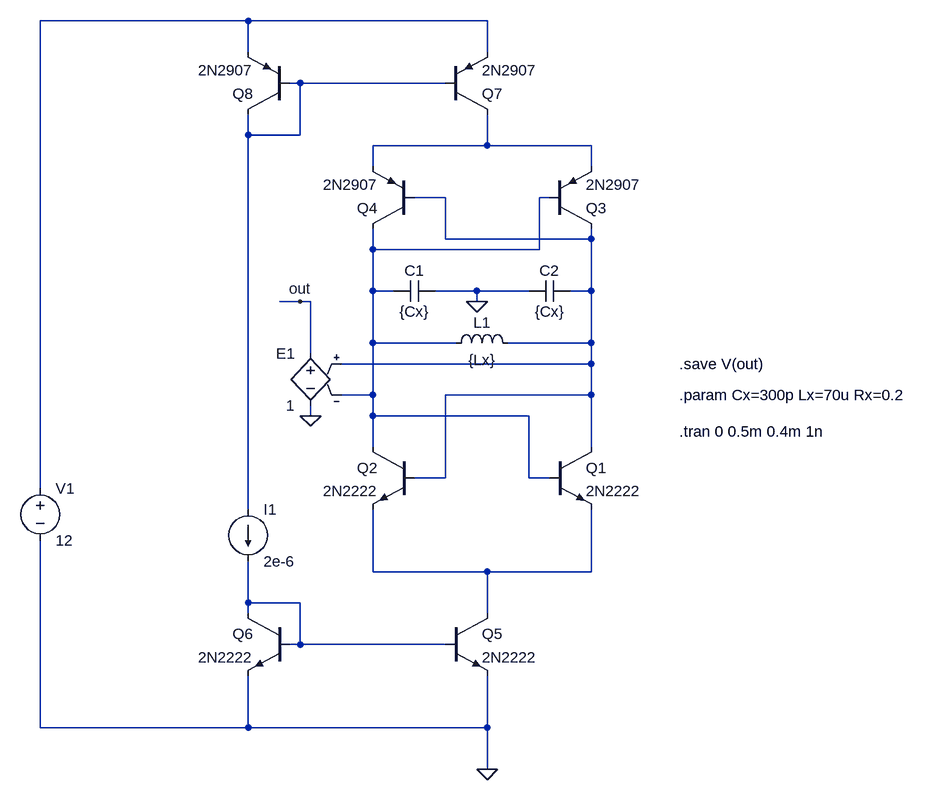
[diagram p0: schematic main.asc]
main.asc, the LTspice schematic file:
Version 4
SHEET 1 1056 692
WIRE -16 -480 -336 -480
WIRE 352 -480 -16 -480
WIRE -16 -432 -16 -480
WIRE 352 -432 352 -480
WIRE 64 -384 48 -384
WIRE 288 -384 64 -384
WIRE -16 -304 -16 -336
WIRE 64 -304 64 -384
WIRE 64 -304 -16 -304
WIRE 352 -288 352 -336
WIRE 352 -288 176 -288
WIRE 512 -288 352 -288
WIRE 176 -256 176 -288
WIRE 512 -256 512 -288
WIRE 288 -208 240 -208
WIRE 448 -208 432 -208
WIRE 288 -144 288 -208
WIRE 512 -144 512 -160
WIRE 512 -144 288 -144
WIRE 176 -128 176 -160
WIRE 432 -128 432 -208
WIRE 432 -128 176 -128
WIRE 176 -64 176 -128
WIRE 208 -64 176 -64
WIRE 336 -64 272 -64
WIRE 416 -64 336 -64
WIRE 512 -64 512 -144
WIRE 512 -64 480 -64
WIRE 64 -48 32 -48
WIRE 80 -48 64 -48
WIRE 336 -48 336 -64
WIRE 176 16 176 -64
WIRE 304 16 176 16
WIRE 512 16 512 -64
WIRE 512 16 384 16
WIRE 80 32 80 -48
WIRE 512 48 512 16
WIRE 512 48 128 48
WIRE 176 96 176 16
WIRE 176 96 128 96
WIRE 512 96 512 48
WIRE 512 96 288 96
WIRE 80 128 80 112
WIRE 176 128 176 96
WIRE 416 128 176 128
WIRE 176 176 176 128
WIRE 512 176 512 96
WIRE 288 224 288 96
WIRE 288 224 240 224
WIRE 416 224 416 128
WIRE 448 224 416 224
WIRE -336 240 -336 -480
WIRE -16 272 -16 -304
WIRE 176 368 176 272
WIRE 352 368 176 368
WIRE 512 368 512 272
WIRE 512 368 352 368
WIRE -16 416 -16 352
WIRE 64 416 -16 416
WIRE -16 432 -16 416
WIRE 352 432 352 368
WIRE 64 480 64 416
WIRE 64 480 48 480
WIRE 288 480 64 480
WIRE -336 608 -336 320
WIRE -16 608 -16 528
WIRE -16 608 -336 608
WIRE 352 608 352 528
WIRE 352 608 -16 608
WIRE 352 672 352 608
FLAG 336 -48 0
FLAG 352 672 0
FLAG 80 128 0
FLAG 64 -48 out
SYMBOL npn 448 176 R0
SYMATTR InstName Q1
SYMATTR Value 2N2222
SYMBOL npn 240 176 M0
SYMATTR InstName Q2
SYMATTR Value 2N2222
SYMBOL ind 288 32 R270
WINDOW 0 32 56 VTop 2
WINDOW 3 5 56 VBottom 2
SYMATTR InstName L1
SYMATTR Value {Lx}
SYMBOL cap 272 -80 R90
WINDOW 0 0 32 VBottom 2
WINDOW 3 32 32 VTop 2
SYMATTR InstName C1
SYMATTR Value {Cx}
SYMBOL cap 480 -80 R90
WINDOW 0 0 32 VBottom 2
WINDOW 3 32 32 VTop 2
SYMATTR InstName C2
SYMATTR Value {Cx}
SYMBOL voltage -336 224 R0
WINDOW 123 0 0 Left 0
WINDOW 39 0 0 Left 0
SYMATTR InstName V1
SYMATTR Value 12
SYMBOL pnp 448 -160 M180
SYMATTR InstName Q3
SYMATTR Value 2N2907
SYMBOL pnp 240 -160 R180
SYMATTR InstName Q4
SYMATTR Value 2N2907
SYMBOL npn 288 432 R0
SYMATTR InstName Q5
SYMATTR Value 2N2222
SYMBOL npn 48 432 M0
SYMATTR InstName Q6
SYMATTR Value 2N2222
SYMBOL current -16 272 R0
WINDOW 123 0 0 Left 0
WINDOW 39 0 0 Left 0
SYMATTR InstName I1
SYMATTR Value 2e-6
SYMBOL pnp 288 -336 M180
SYMATTR InstName Q7
SYMATTR Value 2N2907
SYMBOL pnp 48 -336 R180
SYMATTR InstName Q8
SYMATTR Value 2N2907
SYMBOL e 80 16 M0
SYMATTR InstName E1
SYMATTR Value 1
TEXT 648 96 Left 2 !.param Cx=300p Lx=70u Rx=0.2
TEXT 648 48 Left 2 !.save V(out)
TEXT 648 152 Left 2 !.tran 0 0.5m 0.4m 1n

The netlist it stands for:
* main.asc
Q1 N004 N005 N006 0 2N2222
Q2 N005 N004 N006 0 2N2222
L1 N005 N004 {Lx}
C1 0 N005 {Cx}
C2 N004 0 {Cx}
V1 N001 0 12
Q3 N004 N005 N003 0 2N2907
Q4 N005 N004 N003 0 2N2907
Q5 N006 N007 0 0 2N2222
Q6 N007 N007 0 0 2N2222
I1 N002 N007 2e-6
Q7 N003 N002 N001 0 2N2907
Q8 N002 N002 N001 0 2N2907
E1 out 0 N004 N005 1
.model NPN NPN
.model PNP PNP
.lib standard.bjt
.param Cx=300p Lx=70u Rx=0.2
.save V(out)
.tran 0 0.5m 0.4m 1n
.backanno
.end